# Altium schematic sheet modFOC-Buck-Supply.SchDoc: modFOC-Buck-Supply
size A4; Author: Thomas Hofmann; CompanyName: HTL St. Pölten; Organization: Altium Limited; Address1: modFOC; Address2: Frenchs Forest; Address3: NSW; Address4: Australia 2086; DocumentNumber: 2; Revision: 2.0; SheetNumber: 3; SheetTotal: 7
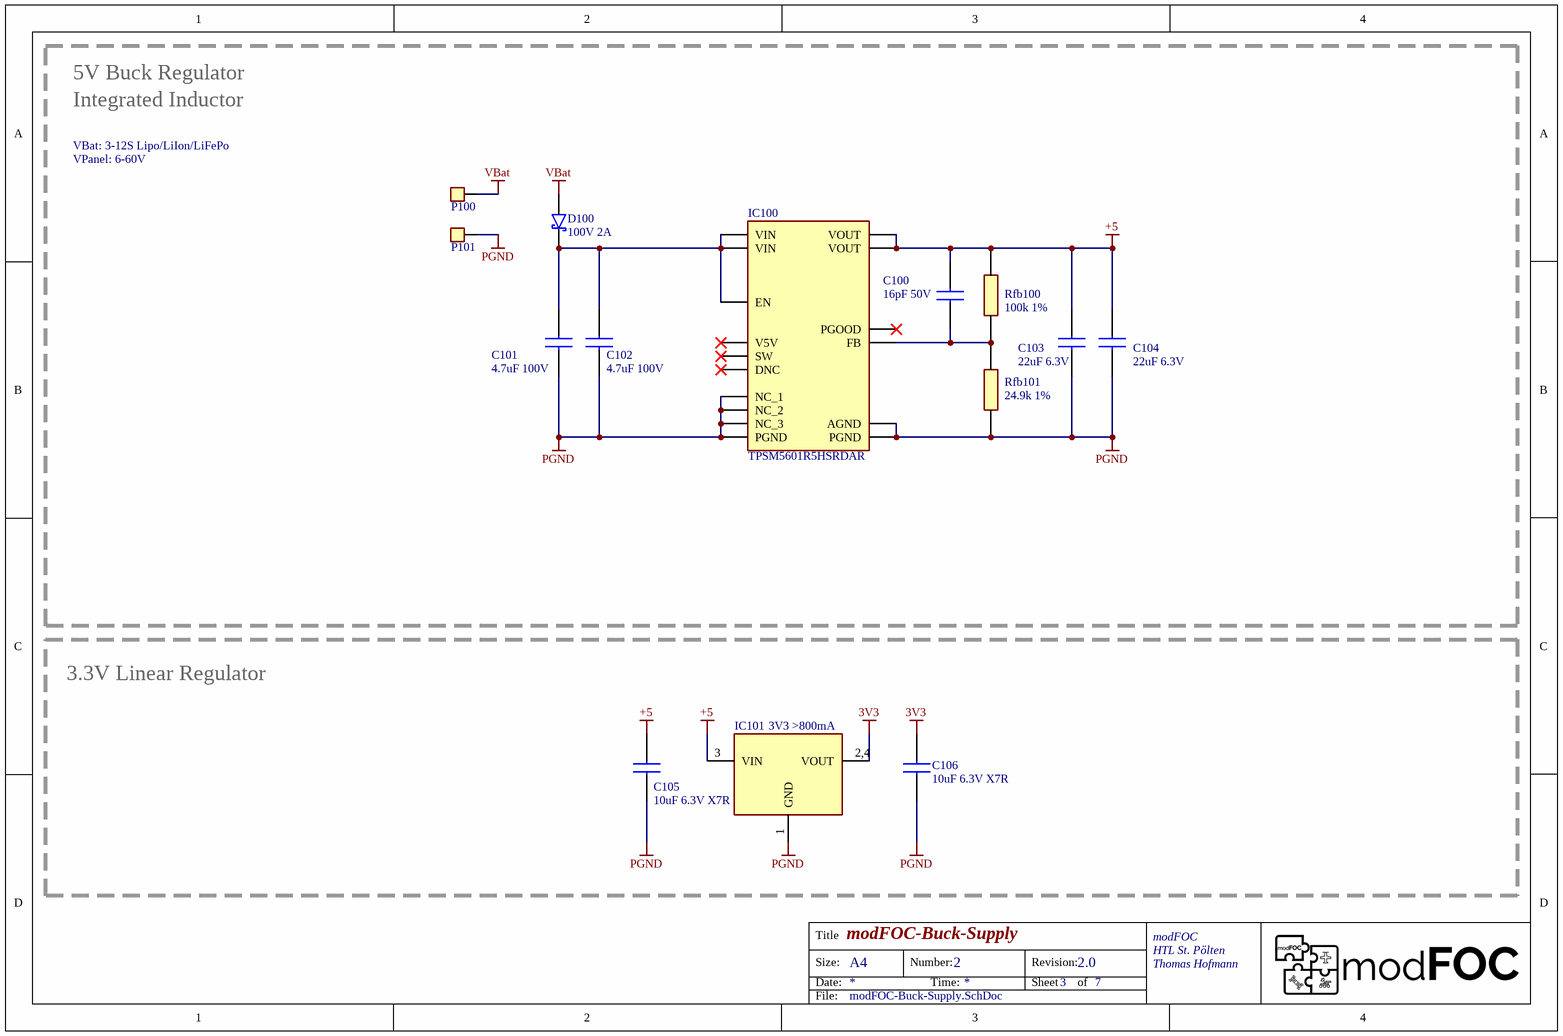
[diagram p0: modFOC-Buck-Supply.SchDoc]

## Parts
C100  16pF 50V  [CAPC1608X97N]
C101  4.7uF 100V  [CAPC3225X270N]
C102  4.7uF 100V  [CAPC3225X270N]
C103  22uF 6.3V  [CAPC3225X270N]
C104  22uF 6.3V  [CAPC3225X270N]
C105  10uF 6.3V X7R  [CAPC3216X180N]
C106  10uF 6.3V X7R  [CAPC3216X180N]
D100  100V 2A  [SOD-123FL]
IC100  TPSM5601R5HSRDAR  [TPSM5601R5HSRDAR]
IC101  3V3 >800mA  [SOT230P700X180-4N]
P100  PowerPad  [POWER_PAD_S]  (value not drawn)
P101  PowerPad  [POWER_PAD_S]  (value not drawn)
Rfb100  100k 1%  [RESC1608X50N]
Rfb101  24.9k 1%  [RESC1608X50N]

## Blocks framed on the sheet
3.3V Linear Regulator: C105 C106 IC101

## Nets
3V3: C106.2 IC101.2,4(VOUT)
+5: C100.2 C103.2 C104.2 C105.2 IC100.7(VOUT) IC100.8(VOUT) IC101.3(VIN) Rfb100.2
PGND: C101.1 C102.1 C103.1 C104.1 C105.1 C106.1 IC100.3(NC_1) IC100.6(NC_2) IC100.10(AGND) IC100.13(NC_3) IC100.15,_16(PGND) IC100.17(PGND) IC101.1(GND) P101.1 Rfb101.1
VBat: D100.2(A) P100.1
NetC100_1: C100.1 IC100.9(FB) Rfb100.1 Rfb101.2
NetC101_2: C101.2 C102.2 D100.1(K) IC100.1(VIN) IC100.2(EN) IC100.14(VIN)

Not connected (* = marked no-connect by the designer): IC100 4(SW)* 5(DNC)* 11(V5V)* 12(PGOOD)*

## Notes on the sheet
- 5V Buck Regulator
- Integrated Inductor
- VBat: 3-12S Lipo/LiIon/LiFePo
- VPanel: 6-60V
- Title
- Size:
- Date:
- A4
- Number:
- Time:
- Revision:
- Sheet
- of
- File:

## Library data of the parts
C100 = C0603: Capacitor; Height: 0.97
C101-C104 = C1210: Capacitor; Height: 0.97mm
C105 C106 = C1206: Capacitor; Height: 1.8mm
D100 = SCHOTTKY-DIODE: Schottky Diode
IC100 = TPSM5601R5HSRDAR: Integrated Circuit; pin to pad: 15, 16>15+16; Manufacturer_Name: Texas Instruments; Datasheet Link: https://www.ti.com/lit/ds/symlink/tpsm5601r5h.pdf?ts=1622688238120&ref_url=https%253A%252F%252Fcomponentsearchengine.com%252F; Height: 4.1mm; Manufacturer_Part_Number: TPSM5601R5HSRDAR; Mouser Part Number: 595-TPSM5601R5HSRDAR; Mouser Price/Stock: https://www.mouser.co.uk/ProductDetail/Texas-Instruments/TPSM5601R5HSRDAR?qs=DRkmTr78QARQPwPAx4O%252BKQ%3D%3D; Arrow Part Number: TPSM5601R5HSRDAR; Arrow Price/Stock: https://www.arrow.com/en/products/tpsm5601r5hsrdar/texas-instruments?region=nac
IC101 = LDO-SOT223: LDO
Rfb100 Rfb101 = R0603: Resistor; Height: 0.55mm